# EAGLE board FJ60BLE (EAGLE 9.6.2), part 1 of 2
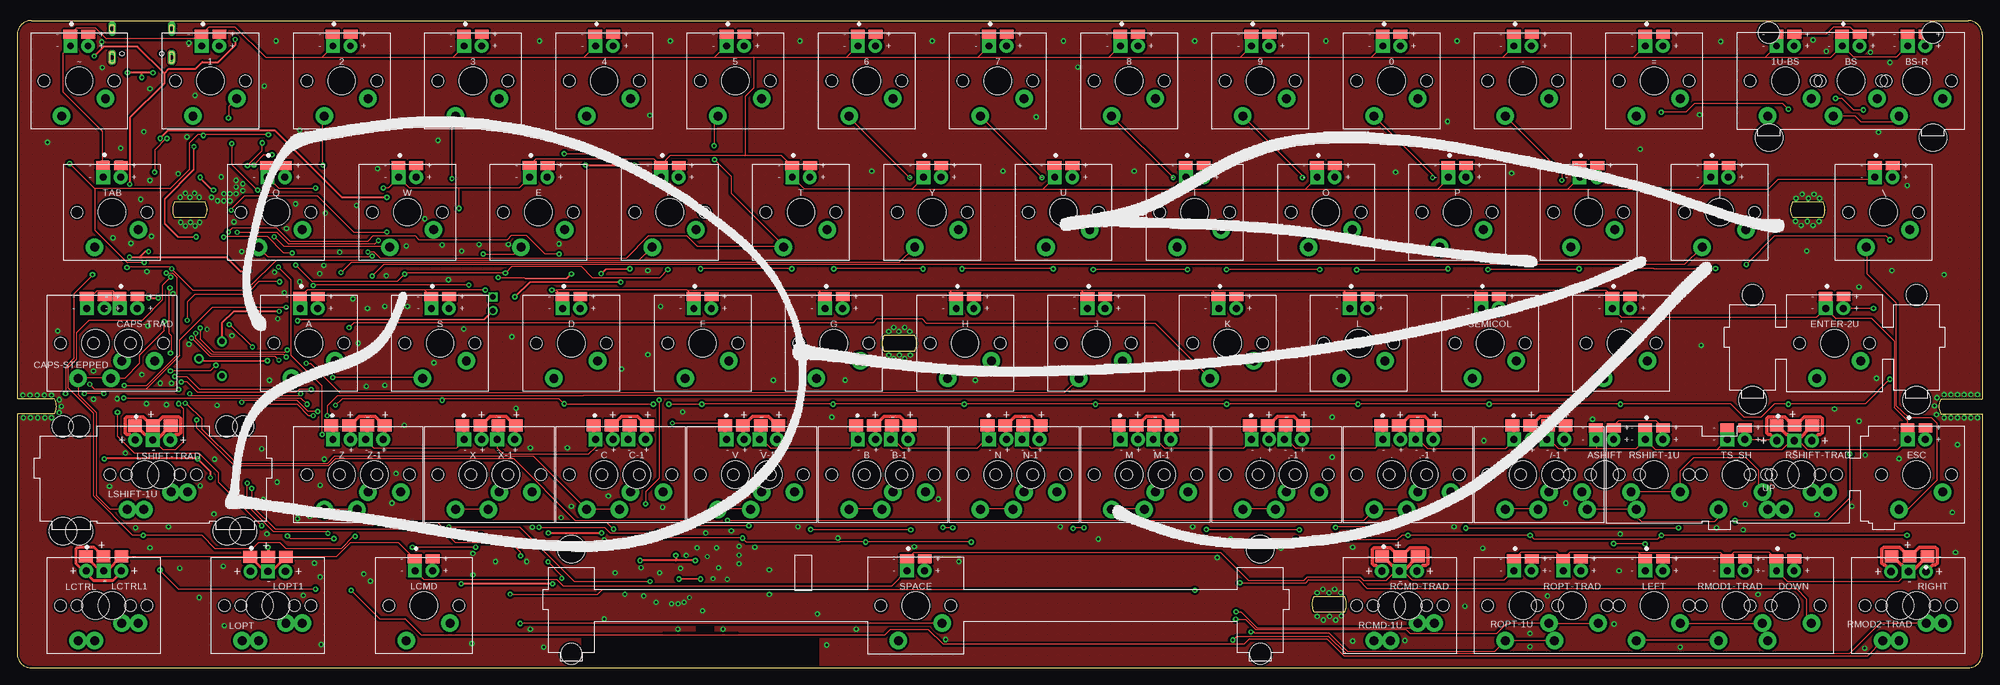
[diagram p7: board, top side]
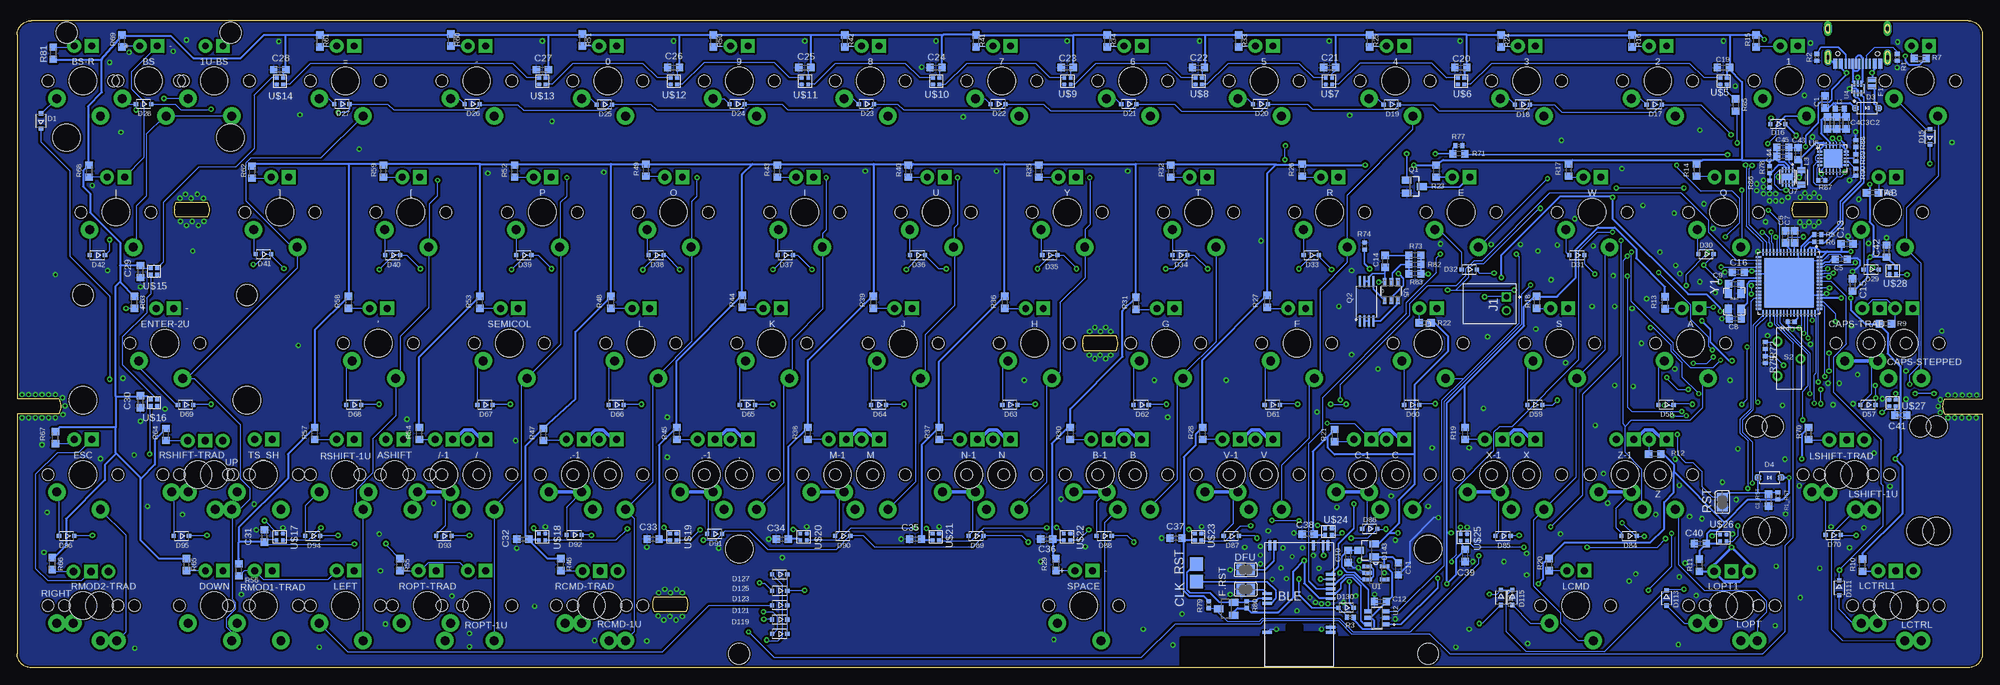
[diagram p8: board, bottom side, seen from below]

Size 285.25 x 93.95 mm. Coordinates in mm from the lower left corner, seen from the top.
Outline: 125.81,48.2 arc52 125.81,46
Outline: 257.65,67.6 arc52 257.65,65.4
Outline: 188.2,10.3 arc52 188.2,8.1
Outline: 27.55,66.53 27.55,66.47
Outline: 125.81,48.2 arc52 125.81,46
Outline: 130.3,46 arc52 130.3,48.2
Outline: 130.55,47.13 130.55,47.07
Outline: 130.3,48.2 125.81,48.2
Outline: 125.81,46 130.3,46
Outline: 188.2,10.3 arc52 188.2,8.1
Outline: 192.69,8.1 arc52 192.69,10.3
Outline: 192.95,9.23 192.95,9.17
Outline: 188.2,8.1 192.69,8.1
Outline: 192.69,10.3 188.2,10.3
Outline: 257.65,67.6 arc52 257.65,65.4
Outline: 262.14,65.4 arc52 262.14,67.6
Outline: 262.4,66.53 262.4,66.47
Outline: 262.14,67.6 257.65,67.6
Outline: 257.65,65.4 262.14,65.4
Outline: 262.14,65.4 arc52 262.14,67.6
Outline: 192.69,8.1 arc52 192.69,10.3
Outline: 130.3,46 arc52 130.3,48.2
Outline: 285.25,91.95 285.25,39.05 279.2,39.05 arc52 279.2,36.85 285.25,36.85 285.25,2 arc-90 283.25,0 2,0 arc-90 0,2 0,36.85 5.44,36.85 arc52 5.44,39.05 0,39.05 0,91.95 arc-90 2,93.95 283.25,93.95 arc-90 285.25,91.95
Outline: 22.81,67.6 arc52 22.81,65.4 27.3,65.4 arc52 27.3,67.6 22.81,67.6
Copper layers (1*16): Top 0.035mm / dielectric 1.5mm / Bottom 0.035mm
Design rules "default *": minimum track width 6mil, minimum drill 0.3mm, track to track 6mil, track to pad 6mil, pad to pad 0.2mm, via to via 6mil, smd to smd 6mil, copper to edge 6mil, drill to drill 6mil, minimum pad ring 10mil, minimum via ring 8mil, stop-mask expansion 4mil, vias tented up to drill 3.1mm, thermal gap 10mil
Net classes: 1 Matrix-Signals: width 0.152 mm, drill 0.152 mm, clearance 0.152 mm; 4 USB-Data: width 0.203 mm
tRestrict: area 82.1,0.1 to 116.2,4.3
bRestrict: area 82.1,0.1 to 116.2,4.3

## Footprints (pad centres in the part's own frame; a part is rotated, then mirrored left to right if it is on the bottom)
MX-1U-THTSMDLED = drill 1 pad 2: LED+ -1.27,-5.08 | drill 1 pad 2 square: LED- 1.27,-5.08 | drill 1.3 pad 2.54: MX1 -3.81,2.54; MX2 2.54,5.08 | smd 2 x 1.3: SMDLED+ -1.3,-6.785; SMDLED- 1.3,-6.785 | hole 4: 0,0 | hole 1.7: -5.08,0; 5.08,0
MX-1U-LED = drill 1 pad 2: LED+ -1.27,-5.08 | drill 1 pad 2 square: LED- 1.27,-5.08 | drill 1.3 pad 2.54: MX1 -3.81,2.54; MX2 2.54,5.08 | hole 4: 0,0 | hole 1.7: -5.08,0; 5.08,0
MDBT40-NO-EXTRA = smd 1.4 x 0.4: 1 -4.6,4; 2 -4.6,3.3; 3 -4.6,-0.9; 4 -4.6,-1.6; 5 -4.6,-2.3; 6 -4.6,-3; 7 -4.6,-3.7; 8 -4.6,-4.4; 34 4.6,-1.6; 35 4.6,-0.9; 36 4.6,-0.191; 42 4.6,4 | smd 0.4 x 1.4: 13 -4.2,-8.6; 14 -3.5,-8.6; 16 -2.1,-8.6; 24 3.5,-8.6; 25 4.2,-8.6
MX-2U-THTSMDLED-FLIPPED = drill 1 pad 2: LED+ -1.27,-5.08 | drill 1 pad 2 square: LED- 1.27,-5.08 | drill 1.3 pad 2.54: MX1 -3.81,2.54; MX2 2.54,5.08 | smd 2 x 1.3: SMDLED+ -1.3,-6.785; SMDLED- 1.3,-6.785 | hole 4: 0,0; -11.9,8.24; 11.9,8.24 | hole 1.7: -5.08,0; 5.08,0 | hole 3.05: -11.9,-7; 11.9,-7
C0603 = smd 1.05 x 1.08: 1 -0.875,0; 2 0.875,0
SOD323-R = smd 0.6 x 0.6: A 1.1,0; C -1.1,0
SOD-123 = smd 1.02 x 0.86: A 1.68,0; C -1.68,0
SOT23 = smd 1 x 1.4: 1 -0.95,-1.1; 2 0.95,-1.1; 3 0,1.1
SJ = smd 1.168 x 1.6: 1 -0.762,0; 2 0.762,0
CAPC1210X112N = smd 0.73 x 1.19: 1 -0.506,0; 2 0.506,0
JST_S2B-PH-K-S(LF)(SN) = drill 0.8 square: 1 -1,0 | drill 0.8: 2 1,0
HEADER-2X1-2.54 = smd 1.905 x 1.905: P$1 -1.27,0; P$2 1.27,0
0402 = smd 0.7 x 0.9: 1 -0.65,0; 2 0.65,0
INDC2009X120 = smd 0.876 x 1.21: 1 -1.067,0; 2 1.067,0
MX-1U = drill 1.3 pad 2.54: MX1 -3.81,2.54; MX2 2.54,5.08 | hole 4: 0,0 | hole 1.7: -5.08,0; 5.08,0
SMD-LED-UNIVERSAL-2-PLACEMENTS = smd 2 x 1.75: MINUS1 -2.63,0; MINUS2 2.57,0; PLUS -0.03,0
LED-THT-2PLACEMENT = drill 1.05 pad 2 square: 1 0,0 | drill 1.05 pad 2: 2 2.54,0; 3 -2.54,0
SMD-LED-UNIVERSAL-DUAL = smd 2 x 1.75: MINUS1 -3.9,0; MINUS2 1.3,0; PLUS1 -1.3,0; PLUS2 3.84,0
MX-2U-FLIPPED = drill 1.3 pad 2.54: MX1 -3.81,2.54; MX2 2.54,5.08 | hole 4: 0,0; -11.9,8.24; 11.9,8.24 | hole 1.7: -5.08,0; 5.08,0 | hole 3.05: -11.9,-7; 11.9,-7
SSOT-3 = smd 1 x 1.4: 1 -0.95,-1.1; 2 0.95,-1.1; 3 0,1.1
SOP65P640X120-8N = smd 1.56 x 0.4: 1 -2.88,0.975; 2 -2.88,0.325; 3 -2.88,-0.325; 4 -2.88,-0.975; 5 2.88,-0.975; 6 2.88,-0.325; 7 2.88,0.325; 8 2.88,0.975
R0402 = smd 0.6 x 0.7: 1 -0.5,0; 2 0.5,0
R0603 = smd 1.05 x 1.08: 1 -0.875,0; 2 0.875,0
SSSS213000 = drill 0.8 pad 1.4: P1 1.65,2.5; P2 -1.65,0; P3 1.65,-2.5
MX-6.25U-THTSMDLED = drill 1 pad 2: LED+ -1.27,-5.08 | drill 1 pad 2 square: LED- 1.27,-5.08 | drill 1.3 pad 2.54: MX1 -3.81,2.54; MX2 2.54,5.08 | smd 2 x 1.3: SMDLED+ -1.3,-6.785; SMDLED- 1.3,-6.785 | hole 4: 0,0; -50,-8.24; 50,-8.24 | hole 1.7: -5.08,0; 5.08,0 | hole 3.05: -50,7; 50,7
SOT95P280X130-5N = smd 1.321 x 0.559: 1 -1.27,0.94; 2 -1.27,0; 3 -1.27,-0.94; 4 1.27,-0.94; 5 1.27,0.94
SOT95P280X145-6N = smd 1.21 x 0.58: 1 -1.255,0.95; 2 -1.255,0; 3 -1.255,-0.95; 4 1.255,-0.95; 5 1.255,0; 6 1.255,0.95
QFN50P900X900X100-65N = smd 0.84 x 0.26: 1 -4.435,3.75; 2 -4.435,3.25; 3 -4.435,2.75; 4 -4.435,2.25; 5 -4.435,1.75; 6 -4.435,1.25; 7 -4.435,0.75; 8 -4.435,0.25; 9 -4.435,-0.25; 10 -4.435,-0.75; 11 -4.435,-1.25; 12 -4.435,-1.75; 13 -4.435,-2.25; 14 -4.435,-2.75; 15 -4.435,-3.25; 16 -4.435,-3.75; 33 4.435,-3.75; 34 4.435,-3.25; 35 4.435,-2.75; 36 4.435,-2.25; 37 4.435,-1.75; 38 4.435,-1.25; 39 4.435,-0.75; 40 4.435,-0.25; 41 4.435,0.25; 42 4.435,0.75; 43 4.435,1.25; 44 4.435,1.75; 45 4.435,2.25; 46 4.435,2.75; 47 4.435,3.25; 48 4.435,3.75 | smd 0.26 x 0.84: 17 -3.75,-4.435; 18 -3.25,-4.435; 19 -2.75,-4.435; 20 -2.25,-4.435; 21 -1.75,-4.435; 22 -1.25,-4.435; 23 -0.75,-4.435; 24 -0.25,-4.435; 25 0.25,-4.435; 26 0.75,-4.435; 27 1.25,-4.435; 28 1.75,-4.435; 29 2.25,-4.435; 30 2.75,-4.435; 31 3.25,-4.435; 32 3.75,-4.435; 49 3.75,4.435; 50 3.25,4.435; 51 2.75,4.435; 52 2.25,4.435; 53 1.75,4.435; 54 1.25,4.435; 55 0.75,4.435; 56 0.25,4.435; 57 -0.25,4.435; 58 -0.75,4.435; 59 -1.25,4.435; 60 -1.75,4.435; 61 -2.25,4.435; 62 -2.75,4.435; 63 -3.25,4.435; 64 -3.75,4.435 | smd 7.15 x 7.15: 65 0,0
SOT50P160X60-6N = smd 0.75 x 0.35: 1 -0.69,0.5; 2 -0.69,0; 3 -0.69,-0.5; 4 0.69,-0.5; 5 0.69,0; 6 0.69,0.5
FS312F-G = smd 1.13 x 0.559: 1 -1.34,0.95; 2 -1.34,0; 3 -1.34,-0.95; 4 1.34,-0.95; 5 1.34,0; 6 1.34,0.95
QFN50P400X400X100-21N = smd 0.84 x 0.26: 1 -1.935,1; 2 -1.935,0.5; 3 -1.935,0; 4 -1.935,-0.5; 5 -1.935,-1; 11 1.935,-1; 12 1.935,-0.5; 13 1.935,0; 14 1.935,0.5; 15 1.935,1 | smd 0.26 x 0.84: 6 -1,-1.935; 7 -0.5,-1.935; 8 0,-1.935; 9 0.5,-1.935; 10 1,-1.935; 16 1,1.935; 17 0.5,1.935; 18 0,1.935; 19 -0.5,1.935; 20 -1,1.935 | smd 2.7 x 2.7: 21 0,0
SON50P200X200X80-9N = smd 0.74 x 0.28: 1 -0.985,0.75; 2 -0.985,0.25; 3 -0.985,-0.25; 4 -0.985,-0.75; 5 0.985,-0.75; 6 0.985,-0.25; 7 0.985,0.25; 8 0.985,0.75 | smd 0.9 x 1.6: 9 0,0
SOT-23 = smd 1 x 1.4: D 0,1.1; G -0.95,-1.1; S 0.95,-1.1
SK6805 = smd 0.55 x 0.55: DIN -0.5,-0.5; DOUT 0.45,0.45; GND -0.5,0.45; VCC 0.45,-0.5
LED0805 = smd 1.2 x 1.25: + 1.05,0; - -1.05,0
TYPE-C-31-M-12 = smd 0.6 x 1.45: A1 -3.25,4.045; A4 -2.45,4.045; B1 3.25,4.045; B4 2.45,4.045 | smd 0.3 x 1.45: A5 -1.25,4.045; A6 -0.25,4.045; A7 0.25,4.045; A8 1.25,4.045; B5 1.75,4.045; B6 0.75,4.045; B7 -0.75,4.045; B8 -1.75,4.045 | drill 0.6 pad 1 long: SHIELD@1 -4.32,3.13; SHIELD@2 4.32,3.13 | drill 0.6 pad 0.8 long: SHIELD@3 4.32,-1.05; SHIELD@4 -4.32,-1.05 | hole 0.65: -2.89,2.6; 2.89,2.6
CRYSTAL-3.2X2.5 = smd 1.3 x 1.05: 1 -1.15,-0.925; 2 1.15,-0.925; 3 1.15,0.925; 4 -1.15,0.925

## Placement (x,y rotation side)
0  KEYSWITCH-THTSMDLED-MX-1U-THTSMDLED  [MX-1U-THTSMDLED]  199.5,85.2 180 top
1  KEYSWITCH-THTSMDLED-MX-1U-THTSMDLED  [MX-1U-THTSMDLED]  28.05,85.2 180 top
1U-BS  KEYSWITCH-THTSMDLED-MX-1U-THTSMDLED  [MX-1U-THTSMDLED]  256.65,85.2 180 top
2  KEYSWITCH-THTSMDLED-MX-1U-THTSMDLED  [MX-1U-THTSMDLED]  47.1,85.2 180 top
3  KEYSWITCH-THTSMDLED-MX-1U-THTSMDLED  [MX-1U-THTSMDLED]  66.15,85.2 180 top
4  KEYSWITCH-THTSMDLED-MX-1U-THTSMDLED  [MX-1U-THTSMDLED]  85.2,85.2 180 top
5  KEYSWITCH-THTSMDLED-MX-1U-THTSMDLED  [MX-1U-THTSMDLED]  104.25,85.2 180 top
6  KEYSWITCH-THTSMDLED-MX-1U-THTSMDLED  [MX-1U-THTSMDLED]  123.3,85.2 180 top
7  KEYSWITCH-THTSMDLED-MX-1U-THTSMDLED  [MX-1U-THTSMDLED]  142.35,85.2 180 top
8  KEYSWITCH-THTSMDLED-MX-1U-THTSMDLED  [MX-1U-THTSMDLED]  161.4,85.2 180 top
9  KEYSWITCH-THTSMDLED-MX-1U-THTSMDLED  [MX-1U-THTSMDLED]  180.45,85.2 180 top
'  KEYSWITCH-THTSMDLED-MX-1U-THTSMDLED  [MX-1U-THTSMDLED]  232.84,47.1 180 top
,  KEYSWITCH-LED-MX-1U-LED  [MX-1U-LED]  180.45,28.05 180 top
,-1  KEYSWITCH-LED-MX-1U-LED  [MX-1U-LED]  185.21,28.05 180 top
-  KEYSWITCH-THTSMDLED-MX-1U-THTSMDLED  [MX-1U-THTSMDLED]  218.55,85.2 180 top
.  KEYSWITCH-LED-MX-1U-LED  [MX-1U-LED]  199.5,28.05 180 top
.-1  KEYSWITCH-LED-MX-1U-LED  [MX-1U-LED]  204.26,28.05 180 top
/  KEYSWITCH-LED-MX-1U-LED  [MX-1U-LED]  218.55,28.05 180 top
/-1  KEYSWITCH-LED-MX-1U-LED  [MX-1U-LED]  223.31,28.05 180 top
=  KEYSWITCH-THTSMDLED-MX-1U-THTSMDLED  [MX-1U-THTSMDLED]  237.6,85.2 180 top
[  KEYSWITCH-THTSMDLED-MX-1U-THTSMDLED  [MX-1U-THTSMDLED]  228.07,66.15 180 top
]  KEYSWITCH-THTSMDLED-MX-1U-THTSMDLED  [MX-1U-THTSMDLED]  247.12,66.15 180 top
A  KEYSWITCH-THTSMDLED-MX-1U-THTSMDLED  [MX-1U-THTSMDLED]  42.34,47.1 180 top
ASHIFT  KEYSWITCH-THTSMDLED-MX-1U-THTSMDLED  [MX-1U-THTSMDLED]  230.46,28.05 180 top
B  KEYSWITCH-LED-MX-1U-LED  [MX-1U-LED]  123.3,28.05 180 top
B-1  KEYSWITCH-LED-MX-1U-LED  [MX-1U-LED]  128.06,28.05 180 top
BLE  MDBT40-NO-EXTRAMDBT40-NO-EXTRA  [MDBT40-NO-EXTRA]  99.19,9.15 180 bottom
BS  KEYSWITCH-THTSMDLED-MX-2U-THTSMDLED-FLIPPED  [MX-2U-THTSMDLED-FLIPPED]  266.18,85.2 180 top
BS-R  KEYSWITCH-THTSMDLED-MX-1U-THTSMDLED  [MX-1U-THTSMDLED]  275.7,85.2 180 top
C  KEYSWITCH-LED-MX-1U-LED  [MX-1U-LED]  85.2,28.05 180 top
C1  10uF  [C0603]  22.84,82.15 270 bottom
C1_RST  100nF  [C0603]  31.03,24.33 90 bottom
C2  10uF  [C0603]  19.79,79.1 90 bottom
C3  1uF  [C0603]  21.13,79.1 90 bottom
C4  100nF  [C0603]  22.47,79.1 90 bottom
C5  100nF  [C0603]  20.46,59.3 180 bottom
C6  1uF  [C0603]  28.57,62.58 270 bottom
C7  1uF  [C0603]  27.23,62.58 270 bottom
C8  12pF  [C0603]  35.86,50.67 180 bottom
C9  12pF  [C0603]  35.94,55.73 0 bottom
C10  1uF  [C0603]  92.05,16.14 90 bottom
C11  10uF  [C0603]  84.75,14.36 90 bottom
C12  1uF  [C0603]  87.36,9.6 0 bottom
C13  10uF  [C0603]  19.64,61.54 180 bottom
C14  100nF  [C0603]  86.69,59.01 90 bottom
C15  10uF  [C0603]  18.82,55.58 270 bottom
C16  10uF  [C0603]  35.42,57.44 0 bottom
C19  100nF  [C0603]  37.58,87.13 0 bottom
C20  100nF  [C0603]  75.67,87.13 0 bottom
C21  100nF  [C0603]  94.73,87.13 0 bottom
C22  100nF  [C0603]  113.78,87.13 0 bottom
C23  100nF  [C0603]  132.82,87.13 0 bottom
C24  100nF  [C0603]  151.88,87.13 0 bottom
C25  100nF  [C0603]  170.92,87.13 0 bottom
C26  100nF  [C0603]  189.97,87.13 0 bottom
C27  100nF  [C0603]  209.02,86.84 0 bottom
C28  100nF  [C0603]  247.12,86.84 0 bottom
C29  100nF  [C0603]  267.37,57.52 90 bottom
C30  100nF  [C0603]  267.37,38.62 90 bottom
C31  100nF  [C0603]  249.36,19.12 270 bottom
C32  100nF  [C0603]  211.85,18.67 0 bottom
C33  100nF  [C0603]  192.95,18.67 0 bottom
C34  100nF  [C0603]  174.2,18.67 0 bottom
C35  100nF  [C0603]  154.85,18.67 0 bottom
C36  100nF  [C0603]  135.8,18.67 0 bottom
C37  100nF  [C0603]  117.05,18.82 0 bottom
C38  100nF  [C0603]  97.85,19.42 0 bottom
C39  100nF  [C0603]  75.08,16.29 90 bottom
C40  100nF  [C0603]  40.92,18 0 bottom
C41  100nF  [C0603]  11.83,36.68 180 bottom
C42  100nF  [C0603]  13.91,60.49 270 bottom
C43  10uF  [C0603]  26.71,74.63 270 bottom
C44  10uF  [C0603]  28.94,74.26 180 bottom
C45  10uF  [C0603]  28.94,75.53 180 bottom
C-1  KEYSWITCH-LED-MX-1U-LED  [MX-1U-LED]  89.96,28.05 180 top
CAPS-STEPPED  KEYSWITCH-THTSMDLED-MX-1U-THTSMDLED  [MX-1U-THTSMDLED]  11.38,47.1 180 top
CAPS-TRAD  KEYSWITCH-THTSMDLED-MX-1U-THTSMDLED  [MX-1U-THTSMDLED]  16.14,47.1 180 top
D  KEYSWITCH-THTSMDLED-MX-1U-THTSMDLED  [MX-1U-THTSMDLED]  80.44,47.1 180 top
D1  [SOD323-R]  281.8,79.4 90 bottom
D3  MBR0520LT1G  [SOD-123]  16.74,81.26 0 bottom
D4  MBR0520LT1G  [SOD-123]  30.88,27.6 180 bottom
D15  [SOD323-R]  7.59,77.09 90 bottom
D16  [SOD323-R]  29.69,78.95 180 bottom
D17  [SOD323-R]  47.62,81.78 180 bottom
D18  [SOD323-R]  66.75,81.78 180 bottom
D19  [SOD323-R]  85.8,81.78 180 bottom
D20  [SOD323-R]  104.77,81.85 180 bottom
D21  [SOD323-R]  123.9,81.85 180 bottom
D22  [SOD323-R]  142.87,81.85 180 bottom
D23  [SOD323-R]  162,81.85 180 bottom
D24  [SOD323-R]  180.75,81.85 180 bottom
D25  [SOD323-R]  200.02,81.78 180 bottom
D26  [SOD323-R]  219.22,81.85 180 bottom
D27  [SOD323-R]  238.12,81.85 180 bottom
D28  [SOD323-R]  266.92,81.85 180 bottom
D29  [SOD323-R]  16.14,57.82 180 bottom
D30  [SOD323-R]  40.11,60.05 180 bottom
D31  [SOD323-R]  58.86,59.9 180 bottom
D32  [SOD323-R]  74.48,57.82 180 bottom
D33  [SOD323-R]  97.4,59.9 180 bottom
D34  [SOD323-R]  116.45,59.9 180 bottom
D35  [SOD323-R]  135.36,59.9 180 bottom
D36  [SOD323-R]  154.55,59.9 180 bottom
D37  [SOD323-R]  173.75,59.9 180 bottom
D38  [SOD323-R]  192.51,59.9 180 bottom
D39  [SOD323-R]  211.7,59.9 180 bottom
D40  [SOD323-R]  230.75,59.9 180 bottom
D41  [SOD323-R]  249.51,60.05 180 bottom
D42  [SOD323-R]  273.62,59.9 180 bottom
D57  [SOD323-R]  16.59,38.17 180 bottom
D58  [SOD323-R]  45.91,38.17 180 bottom
D59  [SOD323-R]  64.96,38.17 180 bottom
D60  [SOD323-R]  82.82,38.17 180 bottom
D61  [SOD323-R]  103.06,38.17 180 bottom
D62  [SOD323-R]  122.11,38.17 180 bottom
D63  [SOD323-R]  141.16,38.17 180 bottom
D64  [SOD323-R]  160.21,38.17 180 bottom
D65  [SOD323-R]  179.26,38.17 180 bottom
D66  [SOD323-R]  198.31,38.17 180 bottom
D67  [SOD323-R]  217.36,38.17 180 bottom
D68  [SOD323-R]  236.41,38.17 180 bottom
D69  [SOD323-R]  260.82,38.17 180 bottom
D70  [SOD323-R]  21.65,19.27 180 bottom
D84  [SOD323-R]  51.27,19.12 180 bottom
D85  [SOD323-R]  69.57,19.12 180 bottom
D86  [SOD323-R]  88.92,20.16 180 bottom
D87  [SOD323-R]  109.01,19.12 180 bottom
D88  [SOD323-R]  127.47,19.12 180 bottom
D89  [SOD323-R]  146.07,19.12 180 bottom
D90  [SOD323-R]  165.42,19.12 180 bottom
D91  [SOD323-R]  184.02,19.42 180 bottom
D92  [SOD323-R]  204.41,19.27 180 bottom
D93  [SOD323-R]  223.31,19.12 180 bottom
D94  [SOD323-R]  242.36,19.12 180 bottom
D95  [SOD323-R]  261.41,19.12 180 bottom
D96  [SOD323-R]  278.08,19.12 180 bottom
D111  [SOD323-R]  20.76,11.6 270 bottom
D113  [SOD323-R]  45.83,10.12 270 bottom
D115  [SOD323-R]  68.23,10.19 270 bottom
D117  [SOD323-R]  69.87,10.19 270 bottom
D119  [SOD323-R]  174.57,4.91 180 bottom
D121  [SOD323-R]  174.57,6.99 180 bottom
D123  [SOD323-R]  174.57,9.07 180 bottom
D125  [SOD323-R]  174.57,11.16 180 bottom
D127  [SOD323-R]  174.57,13.54 180 bottom
D130  [SOD323-R]  92.34,8.7 180 bottom
D143  PMEG2005CT  [SOT23]  89.37,17.04 90 bottom
DFU  [SJ]  106.93,14.21 180 bottom
DOWN  KEYSWITCH-THTSMDLED-MX-1U-THTSMDLED  [MX-1U-THTSMDLED]  256.65,9 180 top
E  KEYSWITCH-THTSMDLED-MX-1U-THTSMDLED  [MX-1U-THTSMDLED]  75.67,66.15 180 top
ENTER-2U  KEYSWITCH-THTSMDLED-MX-2U-THTSMDLED-FLIPPED  [MX-2U-THTSMDLED-FLIPPED]  263.79,47.1 180 top
ESC  KEYSWITCH-THTSMDLED-MX-1U-THTSMDLED  [MX-1U-THTSMDLED]  275.7,28.05 180 top
F  KEYSWITCH-THTSMDLED-MX-1U-THTSMDLED  [MX-1U-THTSMDLED]  99.49,47.1 180 top
F1  MF-MSMF075-2  [CAPC1210X112N]  15.99,84.9 270 bottom
F.RST  [SJ]  106.93,11.38 180 bottom
G  KEYSWITCH-THTSMDLED-MX-1U-THTSMDLED  [MX-1U-THTSMDLED]  118.54,47.1 180 top
H  KEYSWITCH-THTSMDLED-MX-1U-THTSMDLED  [MX-1U-THTSMDLED]  137.59,47.1 180 top
I  KEYSWITCH-THTSMDLED-MX-1U-THTSMDLED  [MX-1U-THTSMDLED]  170.92,66.15 180 top
J  KEYSWITCH-THTSMDLED-MX-1U-THTSMDLED  [MX-1U-THTSMDLED]  156.64,47.1 180 top
J1  S2B-PH-K-S(LF)(SN)  [JST_S2B-PH-K-S(LF)(SN)]  69.05,52.83 270 bottom
J2  SWD-2-WIRE  [HEADER-2X1-2.54]  114.07,13.76 270 bottom
K  KEYSWITCH-THTSMDLED-MX-1U-THTSMDLED  [MX-1U-THTSMDLED]  175.69,47.1 180 top
L  KEYSWITCH-THTSMDLED-MX-1U-THTSMDLED  [MX-1U-THTSMDLED]  194.74,47.1 180 top
L2  120Ω @ 100MHz  [0402]  20.68,81.18 0 bottom
L3  1uH  [INDC2009X120]  26.26,71.21 270 bottom
LCMD  KEYSWITCH-THTSMDLED-MX-1U-THTSMDLED  [MX-1U-THTSMDLED]  59.01,9 180 top
LCTRL  KEYSWITCH-PLAIN-MX-1U  [MX-1U]  11.38,9 180 top
LCTRL1  KEYSWITCH-PLAIN-MX-1U  [MX-1U]  13.76,9 180 top
LCTRL-LSMD1  [SMD-LED-UNIVERSAL-2-PLACEMENTS]  12.5,16.14 180 top
LCTRL-LTHT1  [LED-THT-2PLACEMENT]  12.57,14.06 0 top
LED1  [SMD-LED-UNIVERSAL-DUAL]  49.48,35.19 0 top
LED2  [SMD-LED-UNIVERSAL-DUAL]  68.53,35.19 0 top
LED3  [SMD-LED-UNIVERSAL-DUAL]  87.58,35.19 0 top
LED4  [SMD-LED-UNIVERSAL-DUAL]  106.63,35.19 0 top
LED5  [SMD-LED-UNIVERSAL-DUAL]  125.68,35.19 0 top
LED6  [SMD-LED-UNIVERSAL-DUAL]  144.73,35.19 0 top
LED7  [SMD-LED-UNIVERSAL-DUAL]  163.78,35.19 0 top
LED8  [SMD-LED-UNIVERSAL-DUAL]  182.83,35.19 0 top
LED9  [SMD-LED-UNIVERSAL-DUAL]  201.88,35.19 0 top
LED10  [SMD-LED-UNIVERSAL-DUAL]  220.93,35.19 0 top
LEFT  KEYSWITCH-THTSMDLED-MX-1U-THTSMDLED  [MX-1U-THTSMDLED]  237.6,9 180 top
LOPT  KEYSWITCH-PLAIN-MX-1U  [MX-1U]  35.19,9 180 top
LOPT1  KEYSWITCH-PLAIN-MX-1U  [MX-1U]  37.58,9 180 top
LOPT-LSMD1  [SMD-LED-UNIVERSAL-2-PLACEMENTS]  36.38,16.07 180 top
LOPT-LTHT1  [LED-THT-2PLACEMENT]  36.38,13.99 0 top
LSHIFT-1U  KEYSWITCH-PLAIN-MX-2U-FLIPPED  [MX-2U-FLIPPED]  18.52,28.05 180 top
LSHIFT-LSMD  [SMD-LED-UNIVERSAL-2-PLACEMENTS]  19.66,35.14 180 top
LSHIFT-LTHT  [LED-THT-2PLACEMENT]  19.67,33.06 0 top
LSHIFT-TRAD  KEYSWITCH-PLAIN-MX-2U-FLIPPED  [MX-2U-FLIPPED]  20.91,28.05 180 top
M  KEYSWITCH-LED-MX-1U-LED  [MX-1U-LED]  161.4,28.05 180 top
M-1  KEYSWITCH-LED-MX-1U-LED  [MX-1U-LED]  166.16,28.05 180 top
N  KEYSWITCH-LED-MX-1U-LED  [MX-1U-LED]  142.35,28.05 180 top
N-1  KEYSWITCH-LED-MX-1U-LED  [MX-1U-LED]  147.11,28.05 180 top
O  KEYSWITCH-THTSMDLED-MX-1U-THTSMDLED  [MX-1U-THTSMDLED]  189.97,66.15 180 top
P  KEYSWITCH-THTSMDLED-MX-1U-THTSMDLED  [MX-1U-THTSMDLED]  209.02,66.15 180 top
Q  KEYSWITCH-THTSMDLED-MX-1U-THTSMDLED  [MX-1U-THTSMDLED]  37.58,66.15 180 top
Q1  FDN337N  [SSOT-3]  82.45,69.87 270 bottom
Q2  FS8205A  [SOP65P640X120-8N]  89.37,53.2 90 bottom
R  KEYSWITCH-THTSMDLED-MX-1U-THTSMDLED  [MX-1U-THTSMDLED]  94.73,66.15 180 top
R1  5.1K  [R0402]  12.35,88.62 90 bottom
R1_RST  10K  [R0402]  29.69,24.92 270 bottom
R2  5.1K  [R0402]  24.03,88.62 270 bottom
R3  10K  [R0402]  91.75,7.29 0 bottom
R4  1K  [R0402]  27.75,50.23 0 bottom
R5  22  [R0402]  23.88,62.88 180 bottom
R6  22  [R0402]  23.88,61.83 180 bottom
R7  300  [R0603]  9,88.47 0 bottom
R8  300  [R0603]  15.92,68.98 180 bottom
R9  300  [R0603]  14.06,49.93 180 bottom
R10  300  [R0603]  17.41,14.88 90 bottom
R11  300  [R0603]  41.07,14.88 90 bottom
R12  300  [R0603]  47.55,31.03 0 bottom
R13  300  [R0603]  46.06,52.98 90 bottom
R14  300  [R0603]  41.44,72.25 90 bottom
R15  300  [R0603]  32.81,91 90 bottom
R16  300  [R0603]  50.82,91 90 bottom
R17  300  [R0603]  60.05,72.25 90 bottom
R18  300  [R0603]  64.66,53.05 90 bottom
R19  300  [R0603]  75.08,34 90 bottom
R20  300  [R0603]  62.88,14.95 90 bottom
R21  300  [R0603]  93.98,33.71 90 bottom
R22  300  [R0603]  80.88,50.08 0 bottom
R23  300  [R0603]  79.25,72.1 90 bottom
R24  300  [R0603]  69.87,91 90 bottom
R25  300  [R0603]  88.92,91 90 bottom
R26  300  [R0603]  98.74,72.25 90 bottom
R27  300  [R0603]  103.8,53.2 90 bottom
R28  300  [R0603]  113.18,34 90 bottom
R29  300  [R0603]  134.46,14.95 90 bottom
R30  300  [R0603]  132.38,34 90 bottom
R31  300  [R0603]  122.85,52.9 90 bottom
R32  300  [R0603]  117.79,72.1 90 bottom
R33  300  [R0603]  107.97,91 90 bottom
R34  300  [R0603]  127.02,91 90 bottom
R35  300  [R0603]  136.99,72.1 90 bottom
R36  300  [R0603]  141.9,53.05 90 bottom
R37  300  [R0603]  151.43,34 90 bottom
R38  300  [R0603]  170.48,34 90 bottom
R39  300  [R0603]  160.95,53.05 90 bottom
R40  300  [R0603]  155.89,72.1 90 bottom
R41  300  [R0603]  146.07,91 90 bottom
R42  300  [R0603]  165.12,91 90 bottom
R43  300  [R0603]  174.94,72.1 90 bottom
R44  300  [R0603]  180,53.2 90 bottom
R45  300  [R0603]  189.53,34 90 bottom
R46  300  [R0603]  206.35,14.95 90 bottom
R47  300  [R0603]  208.88,33.85 90 bottom
R48  300  [R0603]  199.05,53.05 90 bottom
R49  300  [R0603]  193.99,72.25 90 bottom
R50  300  [R0603]  184.17,91 90 bottom
R51  300  [R0603]  203.22,91.15 90 bottom
R52  300  [R0603]  213.04,72.1 90 bottom
R53  300  [R0603]  218.1,53.05 90 bottom
R54  300  [R0603]  226.88,34 90 bottom
R55  300  [R0603]  229.71,14.95 90 bottom
R56  300  [R0603]  253.08,14.21 90 bottom
R57  300  [R0603]  242.06,34 90 bottom
R58  300  [R0603]  237.15,53.05 90 bottom
R59  300  [R0603]  232.09,72.1 90 bottom
R60  300  [R0603]  222.27,91.15 90 bottom
R61  300  [R0603]  241.32,91 90 bottom
R62  300  [R0603]  251.14,71.95 90 bottom
R63  300  [R0603]  268.26,53.05 90 bottom
R64  300  [R0603]  263.64,33.85 90 bottom
R65  300  [R0603]  260.67,14.95 90 bottom
R66  300  [R0603]  280.16,15.1 90 bottom
R67  300  [R0603]  279.72,33.41 90 bottom
R68  300  [R0603]  274.81,72.1 90 bottom
R69  300  [R0603]  270.04,91 90 bottom
R70  300  [R0603]  25.22,34 90 bottom
R71  300  [R0603]  75.97,74.63 180 bottom
R72  7.2K  [R0402]  31.47,46.8 270 bottom
R73  300  [R0603]  82.37,59.9 0 bottom
R74  1K  [R0402]  89.66,61.24 270 bottom
R75  10K  [R0402]  31.47,44.72 270 bottom
R77  10K  [R0402]  75.97,75.82 180 bottom
R78  270K  [R0402]  30.88,72.33 90 bottom
R79  10K  [R0402]  112.29,9.15 270 bottom
R80  10K  [R0402]  106.78,9.15 90 bottom
R81  300  [R0603]  280.02,89.22 270 bottom
R82  300  [R0603]  82.37,58.56 0 bottom
R83  300  [R0603]  82.37,57.22 0 bottom
R85  300  [R0603]  35.79,81.7 90 bottom
R86  100K  [R0402]  30.88,70.24 90 bottom
R87  10K  [R0402]  23.29,70.76 180 bottom
R88  1K  [R0402]  18.38,76.12 270 bottom
R89  1K  [R0402]  18.38,74.04 270 bottom
R90  100K  [R0402]  18.38,71.95 90 bottom
RCMD-1U  KEYSWITCH-PLAIN-MX-1U  [MX-1U]  199.5,9 180 top
RCMD-LSMD  [SMD-LED-UNIVERSAL-2-PLACEMENTS]  200.7,16.15 180 top
RCMD-LTHT  [LED-THT-2PLACEMENT]  200.65,14.01 0 top
RCMD-TRAD  KEYSWITCH-PLAIN-MX-1U  [MX-1U]  201.88,9 180 top
RIGHT  KEYSWITCH-PLAIN-MX-1U  [MX-1U]  275.7,9 180 top
RIGHT-LSMD  [SMD-LED-UNIVERSAL-2-PLACEMENTS]  274.66,16.18 180 top
RIGHT-LTHT  [LED-THT-2PLACEMENT]  274.55,13.95 0 top
RMOD1-TRAD  KEYSWITCH-THTSMDLED-MX-1U-THTSMDLED  [MX-1U-THTSMDLED]  249.51,9 180 top
RMOD2-TRAD  KEYSWITCH-PLAIN-MX-1U  [MX-1U]  273.32,9 180 top
ROPT-1U  KEYSWITCH-THTSMDLED-MX-1U-THTSMDLED  [MX-1U-THTSMDLED]  218.55,9 180 top
ROPT-TRAD  KEYSWITCH-THTSMDLED-MX-1U-THTSMDLED  [MX-1U-THTSMDLED]  225.69,9 180 top
RSHIFT-1U  KEYSWITCH-THTSMDLED-MX-1U-THTSMDLED  [MX-1U-THTSMDLED]  237.6,28.05 180 top
RSHIFT-TRAD  KEYSWITCH-PLAIN-MX-1U  [MX-1U]  259.03,28.05 180 top
RST  [SJ]  37.72,24.03 90 bottom
S  KEYSWITCH-THTSMDLED-MX-1U-THTSMDLED  [MX-1U-THTSMDLED]  61.39,47.1 180 top
S2  SSSS213000  [SSSS213000]  28.05,44.87 180 bottom
SEMICOL  KEYSWITCH-THTSMDLED-MX-1U-THTSMDLED  [MX-1U-THTSMDLED]  213.79,47.1 180 top
SPACE  KEYSWITCH-THTSMDLED-MX-6.25U-THTSMDLED  [MX-6.25U-THTSMDLED]  130.44,9 180 top
T  KEYSWITCH-THTSMDLED-MX-1U-THTSMDLED  [MX-1U-THTSMDLED]  113.78,66.15 180 top
TAB  KEYSWITCH-THTSMDLED-MX-1U-THTSMDLED  [MX-1U-THTSMDLED]  13.76,66.15 180 top
TS_SH  KEYSWITCH-THTSMDLED-MX-1U-THTSMDLED  [MX-1U-THTSMDLED]  249.51,28.05 180 top
U  KEYSWITCH-THTSMDLED-MX-1U-THTSMDLED  [MX-1U-THTSMDLED]  151.88,66.15 180 top
U1  MIC5205-3.3YM5TR  [SOT95P280X130-5N]  88.03,13.76 0 bottom
U2  SN74LVC2G34DBVR  [SOT95P280X145-6N]  87.88,7.21 180 bottom
U3  AT90USB646  [QFN50P900X900X100-65N]  28.05,55.88 270 bottom
U4  USBLC6-2P6  [SOT50P160X60-6N]  18.08,84.08 90 bottom
U5  FS312F-G  [FS312F-G]  85.8,54.69 90 bottom
U6  MCP73871-2AAI/ML  [QFN50P400X400X100-21N]  21.65,73.96 0 bottom
U7  TPS61252DSGT  [SON50P200X200X80-9N]  28.27,71.28 270 bottom
U$1  BSS138  [SOT-23]  109.76,8.55 90 bottom
U$3  [FJLABSLOGO]  167.65,9.6 0 bottom
U$4  [FJ60BLXV1.0]  167.65,2.15 0 bottom
U$5  SK6805  [SK6805]  37.58,85.2 90 bottom
U$6  SK6805  [SK6805]  75.67,85.2 90 bottom
U$7  SK6805  [SK6805]  94.87,85.2 90 bottom
U$8  SK6805  [SK6805]  113.78,85.2 90 bottom
U$9  SK6805  [SK6805]  132.82,85.2 90 bottom
U$10  SK6805  [SK6805]  151.88,85.2 90 bottom
U$11  SK6805  [SK6805]  170.92,85.2 90 bottom
U$12  SK6805  [SK6805]  189.97,85.2 90 bottom
U$13  SK6805  [SK6805]  209.02,85.2 90 bottom
U$14  SK6805  [SK6805]  247.12,85.2 90 bottom
U$15  SK6805  [SK6805]  265.43,57.52 180 bottom
U$16  SK6805  [SK6805]  265.43,38.47 180 bottom
U$17  SK6805  [SK6805]  247.12,18.97 270 bottom
U$18  SK6805  [SK6805]  209.02,18.97 270 bottom
U$19  SK6805  [SK6805]  189.97,18.97 270 bottom
U$20  SK6805  [SK6805]  171.07,18.97 270 bottom
U$21  SK6805  [SK6805]  151.88,18.97 270 bottom
U$22  SK6805  [SK6805]  132.82,18.97 270 bottom
U$23  SK6805  [SK6805]  113.78,18.97 270 bottom
U$24  SK6805  [SK6805]  94.87,19.72 270 bottom
U$25  SK6805  [SK6805]  75.23,18.9 270 bottom
U$26  SK6805  [SK6805]  37.58,18.82 270 bottom
U$27  SK6805  [SK6805]  13.02,38.47 0 bottom
U$28  SK6805  [SK6805]  13.02,57.67 90 bottom
U$29  LED-0805  [LED0805]  11.23,16 0 top
U$30  LED-0805  [LED0805]  35.12,15.85 0 top
U$31  LED-0805  [LED0805]  59.01,15.77 0 top
U$32  LED-0805  [LED0805]  130.44,15.77 0 top
U$33  LED-0805  [LED0805]  199.43,16.07 0 top
U$34  LED-0805  [LED0805]  218.55,15.77 0 top
U$35  LED-0805  [LED0805]  237.6,34.82 0 top
U$36  LED-0805  [LED0805]  237.6,15.77 0 top
U$37  LED-0805  [LED0805]  180.23,35.12 0 top
U$38  LED-0805  [LED0805]  218.33,35.12 0 top
U$39  LED-0805  [LED0805]  142.13,35.12 0 top
U$40  LED-0805  [LED0805]  123.08,35.12 0 top
U$41  LED-0805  [LED0805]  156.64,53.87 0 top
U$42  LED-0805  [LED0805]  104.03,35.12 0 top
U$43  LED-0805  [LED0805]  199.28,35.12 0 top
U$44  LED-0805  [LED0805]  16.14,53.87 0 top
U$45  LED-0805  [LED0805]  256.65,15.77 0 top
U$46  LED-0805  [LED0805]  161.18,35.12 0 top
U$47  LED-0805  [LED0805]  151.88,72.92 0 top
U$48  LED-0805  [LED0805]  84.98,35.12 0 top
U$49  LED-0805  [LED0805]  276,16.07 180 top
U$50  LED-0805  [LED0805]  137.59,53.87 0 top
U$51  LED-0805  [LED0805]  256.72,35.05 0 top
U$52  LED-0805  [LED0805]  80.44,53.87 0 top
U$53  LED-0805  [LED0805]  247.12,72.92 0 top
U$54  LED-0805  [LED0805]  170.92,72.92 0 top
U$55  LED-0805  [LED0805]  275.7,34.82 0 top
U$56  LED-0805  [LED0805]  61.39,53.87 0 top
U$57  LED-0805  [LED0805]  175.69,53.87 0 top
U$58  LED-0805  [LED0805]  270.94,72.92 0 top
U$59  LED-0805  [LED0805]  42.34,53.87 0 top
U$60  LED-0805  [LED0805]  94.73,72.92 0 top
U$61  LED-0805  [LED0805]  118.54,53.87 0 top
U$62  LED-0805  [LED0805]  99.49,53.87 0 top
U$63  LED-0805  [LED0805]  199.5,91.97 0 top
U$64  LED-0805  [LED0805]  28.05,91.97 0 top
U$65  LED-0805  [LED0805]  9,91.97 0 top
U$66  LED-0805  [LED0805]  228.07,72.92 0 top
U$67  LED-0805  [LED0805]  218.55,91.97 0 top
U$68  LED-0805  [LED0805]  237.6,91.97 0 top
U$69  LED-0805  [LED0805]  113.78,72.92 0 top
U$70  LED-0805  [LED0805]  47.1,91.97 0 top
U$71  LED-0805  [LED0805]  75.67,72.92 0 top
U$72  LED-0805  [LED0805]  56.62,72.92 0 top
U$73  LED-0805  [LED0805]  132.82,72.92 0 top
U$74  LED-0805  [LED0805]  104.25,91.97 0 top
U$75  LED-0805  [LED0805]  66.15,91.97 0 top
U$76  LED-0805  [LED0805]  263.79,53.87 0 top
U$77  LED-0805  [LED0805]  37.58,72.92 0 top
U$78  LED-0805  [LED0805]  266.18,91.97 0 top
U$79  LED-0805  [LED0805]  161.4,91.97 0 top
U$80  LED-0805  [LED0805]  85.2,91.97 0 top
U$81  LED-0805  [LED0805]  18.38,34.97 0 top
U$82  LED-0805  [LED0805]  194.74,53.87 0 top
U$83  LED-0805  [LED0805]  180.45,91.97 0 top
U$84  LED-0805  [LED0805]  142.35,91.97 0 top
U$85  LED-0805  [LED0805]  123.3,91.97 0 top
U$86  LED-0805  [LED0805]  46.88,35.12 0 top
U$87  LED-0805  [LED0805]  213.79,53.87 0 top
U$88  LED-0805  [LED0805]  13.76,73 0 top
U$89  LED-0805  [LED0805]  209.02,72.92 0 top
U$90  LED-0805  [LED0805]  189.97,72.92 0 top
U$91  LED-0805  [LED0805]  65.93,35.12 0 top
U$92  LED-0805  [LED0805]  232.84,53.87 0 top
U$93  [WHITE_TULIP]  25.15,12.13 0 top
UP  KEYSWITCH-PLAIN-MX-1U  [MX-1U]  256.65,28.05 180 top
UP-LSMD  [SMD-LED-UNIVERSAL-2-PLACEMENTS]  257.96,35.16 180 top
UP-LTHT  [LED-THT-2PLACEMENT]  257.95,32.95 0 top
USB-C  USB-C  [TYPE-C-31-M-12]  18.08,91.75 180 bottom
V  KEYSWITCH-LED-MX-1U-LED  [MX-1U-LED]  104.25,28.05 180 top
V-1  KEYSWITCH-LED-MX-1U-LED  [MX-1U-LED]  109.01,28.05 180 top
W  KEYSWITCH-THTSMDLED-MX-1U-THTSMDLED  [MX-1U-THTSMDLED]  56.62,66.15 180 top
X  KEYSWITCH-LED-MX-1U-LED  [MX-1U-LED]  66.15,28.05 180 top
X-1  KEYSWITCH-LED-MX-1U-LED  [MX-1U-LED]  70.91,28.05 180 top
Y  KEYSWITCH-THTSMDLED-MX-1U-THTSMDLED  [MX-1U-THTSMDLED]  132.82,66.15 180 top
Y1  8MHz  [CRYSTAL-3.2X2.5]  35.94,53.2 90 bottom
Z  KEYSWITCH-LED-MX-1U-LED  [MX-1U-LED]  47.1,28.05 180 top
Z-1  KEYSWITCH-LED-MX-1U-LED  [MX-1U-LED]  51.86,28.05 180 top
|  KEYSWITCH-THTSMDLED-MX-1U-THTSMDLED  [MX-1U-THTSMDLED]  270.94,66.15 180 top
~  KEYSWITCH-THTSMDLED-MX-1U-THTSMDLED  [MX-1U-THTSMDLED]  9,85.2 180 top

## Tracks (layer width: path | path; a pad name or v marks a point on that pad's centre or on a via)
ADCV  (via drill 0.35)
  Top 0.152: v22.25,43.08 27.98,43.08 28.84,43.93 v28.85,43.93 | v22.25,45.69 22.38,45.82 22.38,48.22 22.01,48.58 22.01,54.98 v22.17,55.14
  Bottom 0.152: R72.2 R75.1 30.14,45.22 v28.85,43.93 | v22.25,45.69 v22.25,43.08 | v22.17,55.14 v22.17,55.13 U3.55
AREF
  Bottom 0.152: C5.2 21.84,59.3
  Bottom 0.203: U3.62 23.17,58.63 22.88,58.92 22.23,58.92 21.84,59.3
BATT+  (via drill 0.3, 0.35)
  Top 0.152: v69.8,56.65 69.9,56.55 73.65,56.55 73.7,56.48
  Top 0.203: v80.44,57.17 80.44,57.15 79.77,56.48 73.7,56.48
  Top 0.254: v38.05,51.75 31.43,51.75 29.7,50.02 S2.P3 | v53.65,68.31 47.11,68.31 37.37,78.04 21.9,78.04 20.76,76.9 v20.76,76.87
  Bottom 0.152: 38.1,51.8 v38.05,51.75 | R72.1 29.76,47.3 S2.P3
  Bottom 0.203: R73.2 R82.2 R83.2 81.45,57.17 v80.44,57.17
  Bottom 0.254: 38.1,51.8 38.1,52.3 40.03,54.23 42.7,54.23 53.68,65.21 53.68,68.28 v53.65,68.31 | v69.8,56.65 69.8,59.95 61.28,68.47 53.81,68.47 v53.65,68.31 | v53.65,68.31 53.76,68.31 | v20.76,76.87 20.07,76.18 20.07,75.51
  Bottom 0.305: U6.14 U6.15 19.71,75.16 20.07,75.51 20.45,75.9 U6.16
BATT-  (via drill 0.35)
  Top 0.203: v72.25,53.86 74.42,56.03 87.55,56.03 v87.6,55.98
  Bottom 0.152: J1.1 69.08,53.86 v72.25,53.86 | U5.6 86.69,56.09
  Bottom 0.203: 86.69,56.09 86.69,57.27 | 86.69,57.27 C14.1 | U5.6 87.55,56.03 v87.6,55.98 | 86.69,57.27 88.56,57.27 89.07,56.75 89.07,56.11 Q2.6
  Bottom 0.254: Q2.7 Q2.6 89.02,56.1
BATTSWITCH  (via drill 0.35)
  Top 0.152: 40.7,50.52 v40.7,50.37 | S2.P2 26.4,44.9 26.45,44.9 26.55,44.87
  Top 0.203: J1.2 67.75,50.52 40.7,50.52 | v36.32,44.57 26.85,44.57 26.55,44.87
  Bottom 0.203: v40.7,50.37 39.45,49.13 39.45,47.33 36.69,44.57 v36.32,44.57
BL  (via drill 0.35)
  Top 0.152: v34.38,73 34.38,73.07 35.79,74.48 v36.98,74.48
  Bottom 0.152: U3.16 31.8,61.71 34.24,64.16 34.24,72.87 v34.38,73 | 75.32,74.48 R71.1 | v34.38,73
  Bottom 0.203: 75.32,74.48 v36.98,74.48
COL1  (via drill 0.3)
  Top 0.152: v21.34,50.27 21.34,48.93 17.81,45.4 17.81,44.23 15.65,42.07 13.72,42.07 CAPS-TRAD.MX2 13.57,42.07 8.85,42.07 CAPS-STEPPED.MX2 8.84,39.64 11.45,37.03 11.45,25.05 13.53,22.97 LSHIFT-1U.MX2 LSHIFT-TRAD.MX2
  Bottom 0.152: LSHIFT-TRAD.MX2 18.45,22.87 21.95,19.37 21.95,5.58 20.34,3.97 LCTRL1.MX2 LCTRL.MX2 | v21.34,50.27 21.34,51.46 23.01,53.12 23.6,53.12 U3.51 | CAPS-STEPPED.MX2 8.85,42.07 8.85,58.68 11.13,60.97 TAB.MX2 10.98,61.21 10.98,66.81 6.39,71.41 6.39,80.05 ~.MX2
COL2  (via drill 0.3)
  Top 0.152: v34.88,69.35 34.85,69.35 31.12,73.08 v31.12,76.09 | v22.87,42.31 23.09,42.31 23.17,42.23 24.65,42.23 26.46,40.43 38.21,40.43 A.MX2 | Z-1.MX2 49.23,23.02 44.66,23.02 Z.MX2 | v51.52,59.75 51.37,59.6 36.43,59.6 35.06,60.97 Q.MX2
  Bottom 0.152: v34.88,69.35 34.88,61.15 34.91,61.12 Q.MX2 | v22.87,42.31 22.87,52.34 23.19,52.66 23.58,52.66 U3.50 | Z.MX2 44.51,22.87 44.11,22.47 44.11,15 40.34,11.23 32.9,11.23 31.34,9.67 31.34,8.03 32.65,6.72 LOPT.MX2 LOPT1.MX2 | 51.82,35.06 50.93,35.95 42.4,35.95 40.55,37.8 40.55,41.31 39.94,41.92 A.MX2 | 51.82,35.06 51.82,31.25 49.39,28.81 49.39,23.02 Z-1.MX2 | v51.52,59.75 52.13,59.14 52.13,35.37 51.82,35.06 | 29.98,78.71 29.98,77.23 v31.12,76.09
  Bottom 0.203: 1.MX2 28.57,80.12 29.98,78.71
COL3  (via drill 0.3)
  Top 0.152: X-1.MX2 68.28,23.02 63.71,23.02 X.MX2 | v23.78,41.46 24.68,41.46 26.19,39.95 40.45,39.95 40.89,40.39 v42.68,40.39 | S.MX2 58.73,42.14 v45.77,42.14 | v37.29,62.57 38.73,61.12 53.96,61.12 W.MX2 | 2.MX2 44.37,79.93 v44.37,72.98
  Bottom 0.152: LCMD.MX2 56.55,3.97 58.74,3.97 61.27,6.5 61.27,7.96 65.2,11.88 65.2,21.38 X.MX2 58.99,27.59 58.99,41.92 S.MX2 58.84,42.07 54.72,46.19 54.72,60.36 54.11,60.97 W.MX2 | v23.78,41.46 23.78,52.05 23.71,52.12 U3.49 | v45.77,42.14 45.77,41.99 44.17,40.39 v42.68,40.39 | v44.37,72.98 44.37,72.68 40.87,69.18 36.29,69.18 35.21,68.1 35.21,64.64 v37.29,62.57
COL4  (via drill 0.3)
  Top 0.152: v24.4,38.41 24.55,38.41 24.78,38.18 26.78,36.17 26.78,34.69 31.9,29.57 44.97,29.57 46.03,30.64 74.99,30.64 C.MX2 82.76,23.02 87.33,23.02 C-1.MX2 | v67.64,60.05 72.09,60.05 73.01,60.97 E.MX2 | 3.MX2 63.1,79.61 v63.1,71.03
  Bottom 0.152: v24.4,38.41 24.4,42.52 24.09,42.83 24.09,50.94 24.3,51.16 U3.48 | v63.1,71.03 73.01,61.12 E.MX2 | C.MX2 78.41,27.22 78.41,38.86 75.25,42.02 | 75.25,42.02 67.27,50 67.27,59.68 v67.64,60.05 | D.MX2 75.25,42.02
COL5  (via drill 0.3)
  Top 0.152: V.MX2 101.81,23.02 106.38,23.02 V-1.MX2 | v33.54,54.26 33.46,54.19 25.75,54.19 24.7,53.13 v24.7,50.45 | v33.54,55.48 33.91,55.48 37.57,59.14 90.23,59.14 92.06,60.97 R.MX2
  Bottom 0.152: V.MX2 101.66,23.02 101.66,29.43 97.7,33.39 97.7,41.31 97.09,41.92 F.MX2 96.94,42.07 96.16,42.84 96.16,54.85 92.21,58.8 92.21,60.97 R.MX2 92.19,68.65 82.66,78.17 4.MX2 | v24.7,50.45 24.7,51.37 U3.47 | v33.54,55.48 v33.54,54.26
COL6  (via drill 0.3, 0.35)
  Top 0.152: B.MX2 120.86,23.02 125.43,23.02 B-1.MX2 | v50.91,60.36 51.84,60.36 52.76,59.44 88.4,59.44 91.6,62.65 97.24,62.65 98.76,61.12 111.11,61.12 | 111.11,61.12 111.38,61.12 103.6,68.9 103.6,71.37 v101.2,73.77 | 111.11,61.12 T.MX2 | v37.98,44.65 37.46,45.17 28.05,45.17 28.04,45.17 25.32,47.89 v25.29,47.89 | 5.MX2 101.15,79.56 v101.15,75.8
  Bottom 0.152: SPACE.MX2 127.87,3.97 127.42,4.42 127.42,21.04 125.59,22.87 B-1.MX2 | v37.98,44.65 39.04,43.6 42.36,43.6 44.86,46.1 44.86,47.16 50.91,53.2 v50.91,60.36 | T.MX2 111.26,60.97 111.26,47.32 115.81,42.77 G.MX2 116.88,41.38 116.88,27.3 120.76,23.42 B.MX2 | v25.29,47.89 25.3,47.9 U3.46 | v101.2,73.77 101.2,75.75 v101.15,75.8
COL7  (via drill 0.3)
  Top 0.152: N.MX2 139.91,23.02 144.48,23.02 N-1.MX2 | v39.17,46.12 38.85,45.8 28.51,45.8 26.59,47.72 v26.59,49.3 | v46.99,57.37 48.45,58.84 128.02,58.84 130.16,60.97 Y.MX2 | v46.99,57.37 | 6.MX2 120.76,79.97 v129.56,71.17
  Bottom 0.152: N.MX2 135.8,26.98 135.8,41.31 135.19,41.92 H.MX2 134.79,42.02 133.9,42.91 133.9,52.99 130.28,56.61 Y.MX2 130.16,61.12 130.16,63.73 129.56,64.33 v129.56,71.17 | v39.17,46.12 39.79,46.74 39.79,48.03 42.38,50.62 42.38,52.74 46.99,57.35 v46.99,57.37 | U3.44 26.3,49.59 v26.59,49.3
COL8  (via drill 0.3)
  Top 0.152: M.MX2 158.96,23.02 163.53,23.02 M-1.MX2 | v41.93,44.2 42.57,44.2 46.9,39.87 151.95,39.87 J.MX2 | v25.92,48.56 25.92,47.82 28.25,45.49 38.65,45.49 v39.03,45.12 | 7.MX2 v148.76,71.17
  Bottom 0.152: v41.93,44.2 39.99,44.2 39.07,45.12 v39.03,45.12 | v148.76,71.17 148.76,70.87 | 148.76,70.87 | 148.76,70.87 148.76,64.33 149.21,63.88 149.21,61.12 U.MX2 149.23,60.96 149.23,52.59 153.5,48.31 153.5,42.62 J.MX2 154.83,41.49 154.83,27 M.MX2 | v25.92,48.56 26,48.56 25.8,48.76 U3.45
COL9  (via drill 0.3, 0.35)
  Top 0.152: ,.MX2 178.01,23.02 182.58,23.02 ,-1.MX2 | v41.16,39.79 40.86,39.49 25.31,39.49 v25.01,39.79 | K.MX2 173.13,42.07 165.22,49.98 132.03,49.98 131.41,50.6 124.71,50.6 124.19,50.08 48.86,50.08 v48.17,49.39 | 8.MX2 v167.81,71.17 | v167.81,71.17
  Bottom 0.152: U3.38 29.27,51.37 29.35,51.29 29.35,50.03 25.01,45.7 v25.01,39.79 | v167.81,71.17 167.81,63.58 168.26,63.13 168.26,61.12 I.MX2 168.28,60.96 168.28,52.14 172.73,47.69 172.73,42.44 K.MX2 174.03,41.38 174.03,26.85 ,.MX2 | v41.16,39.79 43.53,42.16 43.53,44.27 45.17,45.9 45.17,46.81 47.75,49.39 v48.17,49.39
COL10  (via drill 0.3)
  Top 0.152: RCMD-1U.MX2 197.06,3.97 199.19,3.97 RCMD-TRAD.MX2 | v26.07,35.98 26.07,34.78 31.58,29.27 45.12,29.27 46.19,30.34 72.09,30.34 81.09,21.34 v99.19,21.34 | v103.1,21.38 103.1,21.34 195.38,21.34 196.91,22.87 ..MX2 197.06,23.02 201.63,23.02 .-1.MX2 | 9.MX2 186.56,71.47 v186.56,71.17
  Bottom 0.152: v186.56,71.17 186.56,68.49 187.31,67.75 187.31,61.12 O.MX2 187.33,60.96 187.33,47.38 192.04,42.67 L.MX2 192.34,41.92 192.95,41.31 192.95,26.98 ..MX2 196.91,22.87 195.69,21.65 195.69,5.19 RCMD-1U.MX2 | v26.07,35.98 26.07,40.14 25.32,40.89 25.32,45.52 29.8,50 U3.37 | v99.19,21.34 99.19,21.38 v103.1,21.38
COL11  (via drill 0.3)
  Top 0.152: /.MX2 216.11,23.02 220.68,23.02 /-1.MX2 | v179.07,5.18 179.51,5.18 179.67,5.02 190.45,5.02 193.18,2.29 214.44,2.29 215.96,3.82 ROPT-1U.MX2 216.11,3.97 223.12,3.97 ROPT-TRAD.MX2 | 0.MX2 205.46,71.62 v205.46,71.17
  Bottom 0.152: v205.46,71.17 205.46,68.49 206.36,67.6 206.36,61.12 P.MX2 206.38,60.96 206.38,46.93 211.23,42.07 SEMICOL.MX2 211.39,41.92 212,41.31 212,27.36 216.01,23.34 /.MX2 215.96,22.87 215.96,3.97 ROPT-1U.MX2 | v179.07,5.18 175.36,1.48 122.04,1.48 117.19,6.32 104.86,6.32 104.41,6.77 93.39,6.77 91.48,4.86 80.16,4.86 77.29,1.99 31.88,1.99 28.6,5.27 28.6,17.76 27.46,18.91 27.46,47.18 30.18,49.91 30.18,51.37 U3.36
COL12  (via drill 0.3)
  Top 0.152: LEFT.MX2 235.16,3.97 246.9,3.97 RMOD1-TRAD.MX2 | v34.15,46.55 30.8,49.9 30.79,49.9 v30.79,49.83 | v42.98,36.58 42.34,36.58 40.7,38.22 v34.9,38.22 | v44.97,36.58 44.97,37.97 46.47,39.48 82.13,39.48 82.15,39.5 227.87,39.5 230.28,41.92 '.MX2 | -.MX2 224.24,71.89 v224.24,70.77 | TS_SH.MX2 246.97,21.78 246.37,21.18 235.8,21.18 235.06,21.93 RSHIFT-1U.MX2 ASHIFT.MX2
  Bottom 0.152: LEFT.MX2 235.01,3.97 235.01,22.87 RSHIFT-1U.MX2 236.01,23.92 236.01,25.92 233.67,28.26 233.67,33.2 230.3,36.57 '.MX2 | v30.79,49.83 30.79,51.37 U3.35 | v34.9,38.22 34.15,38.97 v34.15,46.55 | v44.97,36.58 v42.98,36.58 | 230.44,41.92 '.MX2 | v224.24,70.77 224.24,68.54 225.41,67.38 225.41,61.12 [.MX2 225.43,60.96 225.43,52.29 229.58,48.13 229.58,42.74 '.MX2
COL13  (via drill 0.3)
  Top 0.152: RSHIFT-TRAD.MX2 256.34,23.02 254.21,23.02 UP.MX2 | v32.59,38.54 32.88,38.83 40.62,38.83 42.25,37.19 v43.59,37.19 | v51.52,56.85 53.2,58.53 242.02,58.53 244.46,60.97 ].MX2
  Bottom 0.152: v51.52,56.85 51.52,37.83 50.89,37.19 v43.59,37.19 | 244.62,61.12 244.61,61.12 ].MX2 | 244.62,61.12 244.62,58.04 260.64,42.02 ENTER-2U.MX2 259.56,42.02 252.87,35.33 252.87,27.48 251.52,26.13 251.52,24.44 253.47,22.49 | U3.34 31.29,51.44 31.29,51.1 32.93,49.47 32.93,38.88 v32.59,38.54 | 244.62,61.12 245.4,61.12 252.03,67.75 252.03,73.35 251.31,74.06 241.12,74.06 =.MX2 | DOWN.MX2 254.11,5.13 254.81,5.84 254.81,7.25 253.51,8.55 253.51,9.45 254,9.94 254,21.96 253.47,22.49 | UP.MX2 253.63,22.49 253.47,22.49
COL14  (via drill 0.3)
  Top 0.152: v48.46,11.24 48.48,11.27 49.87,9.87 52.63,7.12 56.34,7.12 58.72,4.73 125.91,4.73 126.67,5.5 132.31,5.5 134.44,3.36 178.04,3.36 178.79,4.12 190.21,4.12 192.65,1.69 268.54,1.69 270.67,3.82 RMOD2-TRAD.MX2 270.82,3.97 273.11,3.97 RIGHT.MX2 | |.MX2 268.54,60.97 268.54,57.16 272.77,52.93 272.77,38.04 274.64,36.24 277.93,36.24 278.74,35.43 278.74,27.27 274.44,22.97 ESC.MX2 | v33.4,26.79 33.41,23.55 37.18,19.78 44.81,19.78 v45.11,19.48 | BS.MX2 266.81,80.12 267.7,79.23 272.27,79.23 BS-R.MX2
  Bottom 0.152: ESC.MX2 273.11,22.87 269.45,19.21 269.45,5.19 270.67,3.97 RMOD2-TRAD.MX2 | v33.4,26.79 33.41,32.8 34.78,34.18 34.78,35.94 33.23,37.49 33.23,49.77 31.8,51.2 U3.33 | |.MX2 267.95,61.52 267.95,67 266.49,68.46 266.49,77.48 263.86,80.12 BS.MX2 1U-BS.MX2 | v48.46,11.24 48.46,11.29 45.11,14.65 v45.11,19.48
CS_3.3V  (via drill 0.35)
  Top 0.203: v99.19,12.87 v96.06,12.87
  Bottom 0.152: D130.A 93.29,8.7 93.29,8.55 92.25,7.51 R3.1
  Bottom 0.203: BLE.7 96.04,12.85 v96.06,12.87 | D130.A 93.47,8.67 97.3,8.67 99.19,10.56 v99.19,12.87
CS_5V  (via drill 0.3)
  Top 0.152: v91.85,12.51 91.81,12.54 80.81,12.54 72.93,20.42 v62.65,20.42 | v31.92,63.22 37.7,63.22 39.4,61.51 51.91,61.51 v52.43,62.04
  Bottom 0.152: v62.65,20.42 58.07,25 58.07,39.65 52.43,45.29 v52.43,62.04 | U3.14 30.79,60.36 30.79,61.54 30.95,61.69 30.95,62.4 31.77,63.22 v31.92,63.22 | v31.92,63.22
  Bottom 0.203: v91.85,12.51 91.85,9.31 D130.C
GND  (via drill 0.3, 0.35)
  Bottom 0.152: 26.68,59.14 23.63,59.14 U3.63 23.14,59.13 22.19,60.07 20.71,60.07 19.95,59.3 C5.1 | 26.68,59.14 26.68,60.21 U3.6 | U3.53 23.63,54.11 28.05,54.11 U3.65 28.05,57.16 | 28.05,57.16 32.32,57.16 U3.22 32.6,57.13 32.62,57.16 | 26.68,59.14 28.05,57.77 28.05,57.16 | v27.55,49.14 v27.55,49.15 28.25,49.85 R4.1 | v90.56,14.51 89.81,13.76 U1.2 | 21.93,73.35 22.59,72.68 22.91,72.68 23.38,72.21 23.38,71.75 v23.36,71.73 23.36,71.34 R87.1 | 21.93,73.35 21.65,73.62 | U6.3 U6.21 | R90.1 18.58,71.45 v19.27,70.76 | U6.11 20.91,72.96 | 20.91,72.96 21.54,72.96 21.93,73.35 | U6.10 20.64,72.43 20.91,72.69 20.91,72.96 | C43.1 26.73,75.53 C45.1 | C45.1 | C45.1 C44.1 28.07,73.43 27.51,72.87 27.51,72.29 U7.1 27.52,71.96 27.81,71.67 27.89,71.67 U7.9 28.66,70.9 28.74,70.9 28.89,70.74 28.89,70.43 U7.5
  Bottom 0.203: C11.1 83.12,15.12 83.12,18.25 79.57,21.79 v78.97,21.79 | C9.2 35.01,55.68 Y1.2 | C5.1 19.51,59.38 | BLE.2 BLE.1 | v102.46,5.58 103.36,5.58 BLE.42 | C10.1 91.28,14.51 v90.56,14.51 | Q2.3 Q2.2
  Bottom 0.254: R86.1 v30.88,68.83 | v30.88,68.83 | C12.1 88.23,10.62 v88.2,10.65 | C15.1 18.91,56.55 | C13.1 19.49,62.26 v19.49,62.65 | C5.1 19.43,59.46 18.11,59.46 17.81,59.16 17.81,58.42 18.77,57.46 v18.82,57.52 C15.1 | v22.62,54.32 22.62,54.26 22.73,54.15 23.59,54.15 23.63,54.11 | U4.2 18.12,83.44 18.12,83.88 18.33,84.08 v19.27,84.08 | C15.1
  Bottom 0.305: USB-C.SHIELD@2 21.48,87.7 USB-C.B1 | C2.1 C3.1 C4.1 | C4.1 | 21.53,73.96 U6.21 21.65,73.62 | C1.1 22.79,82.97 | R88.1 v18.38,77.83
  other vias: 37.81,50.66 99.5,8.24 43.97,26.49 35.49,31.77 37.72,26.93 246.68,20.31 23.59,14.43 244.22,80.29 259.78,60.49 193.84,17.48 190.87,30.58 190.87,36.38 117.5,3.27 279.72,57.07 228.67,36.09 26.41,10.19 43.16,15.18 51.27,12.57 4.39,76.27 13.91,62.43 104.7,61.98 212.75,17.33 244.45,46.8 21.65,38.17 56.18,35.19 71.81,48.07 53.35,52.46 56.62,52.46 50.82,52.16 52.31,72.48 232.54,14.06 232.69,19.42 231.8,6.32 261.26,22.25 281.65,32.37 280.91,22.54 281.36,16.74 272.13,57.67 271.83,87.88 247.27,90.93 235.59,75.3 91.53,45.46 87.73,43.38 93.68,23.29 103.65,19.86 109.16,14.21 133.72,24.48 72.4,37.65 60.49,44.27 56.48,61.24 35.71,24.4 26.56,26.41 28.65,30.28 20.76,41.3 18.97,49.63 134.76,4.09 174.2,16 183.43,17.33 201.43,3.94 219.59,3.05 219.59,4.98 120.17,41.74 139.08,41.74 109.76,41.74 80.44,23.44 85.2,18.53 74.48,5.58 61.24,19.42 66.15,16.59 15.03,75.45 12.35,87.13 12.27,90.86 24.92,90.71 268.26,30.88 50.3,13.61 41.52,10.49 54.39,23.88 47.4,22.25 44.57,30.28 31.18,48.22 24.92,46.95 15.7,31.18 17.19,20.31 19.27,17.41 66,3.49 79.84,31.92 59.16,65.18 78.65,61.54 274.36,70.02 270.19,77.76 44.72,66 49.48,47.1 61.09,76.57 49.26,67.12 66.15,13.47 22.39,41.3 5.87,48.89 18.75,38.32 46.8,60.35 71.28,61.46 53.35,41 64.81,49.18 118.24,36.38 50.67,40.85 44.5,58.41 67.04,61.46 54.99,28.2 207.61,79.32 94.8,91 41,78.06 91.82,80.21 269.9,42.04 61.69,61.39 74.48,31.92 62.58,56.33 25.82,83.12 147.93,79.99 153.96,87.21 38.77,54.47 18.08,42.56 241.4,2.97 121.81,5.58 91.53,57.67 36.61,41.74 53.57,56.92 41,56.03 96.59,37.13 32.59,60.42 48.74,53.57 44.64,43.38 29.02,38.1 11.08,38.99 28.57,22.32 269,89.37 262.6,89.52 260.67,91.15 267.37,35.79 200.1,71.95 216.91,71.81 224.8,23.88 212.89,32.96 93.39,52.46 64.51,60.49 21.95,20.46 136.69,15.4 250.85,23.73 43.97,13.17 42.49,21.95 85.2,7.07 95.92,5.58 116.16,7.81 85.8,24.92 76.42,2.97 90.93,10.41 37.58,91 75.82,91 113.63,91 132.82,91 151.88,91 170.92,91 189.97,91 209.02,91 263.79,37.58 267.37,55.29 250.55,20.01 156.94,18.67 162.14,72.1 143.09,72.1 124.04,72.1 119.13,18.82 14.51,39.06 97.11,16.29 99.93,19.57 266.32,23.44 109.16,10.64 69.42,15.4 113.33,20.46 176.13,18.67 170.63,20.46 151.43,20.46 208.58,20.46 36.24,19.42 29.91,14.73 44.12,3.34 107.08,17.48 130.22,17.56 11.08,43.08 43.9,57.22 24.63,77.09 31.47,64.74 74.78,20.39 73.96,15.4 273.17,30.36 40.4,67.34 29.61,71.28 29.98,68.83 31.77,68.83 30.88,67.79 29.98,67.79 29.09,67.79 31.77,69.8 31.77,70.76 32.74,70.24 32.74,69.28 28.2,68.31 26.41,68.31 25.07,68.31 23.66,68.31 25.15,64.66 26.49,64.66 23.73,64.66 0.81,39.58 1.86,39.58 2.9,39.58 3.94,39.58 4.98,39.58 6.1,38.91 6.4,37.95 6.1,37.05 4.98,36.31 4.01,36.31 2.97,36.31 1.93,36.31 0.89,36.31 126.5,48.81 127.99,48.81 129.55,48.81 126.5,45.39 128.06,45.39 129.63,45.39 188.71,10.86 190.42,10.86 192.13,10.86 192.21,7.51 190.5,7.44 188.71,7.44 189.53,11.38 191.24,11.38 191.39,6.92 189.6,6.92 128.81,44.87 127.24,44.87 127.24,49.41 128.81,49.41 24.4,64.14 25.82,64.14 25.74,68.9 24.4,68.9 284.56,39.66 283.59,39.66 282.62,39.66 281.65,39.66 280.69,39.66 279.72,39.66 278.68,39.21 278.3,38.02 278.6,36.76 279.72,36.31 280.69,36.31 281.65,36.31 282.62,36.31 283.59,36.31 284.56,36.31 261.64,68.16 260,68.16 258.21,68.16 258.14,64.81 259.85,64.81 261.56,64.81 258.96,64.22 260.67,64.22 259.11,68.75 260.82,68.75 17.93,68.01 16.52,61.61 35.86,84.46 39.06,63.77 210.14,8.93 193.84,3.87 222.12,10.41 268.18,2.82 252.71,10.64 40.7,21.65 94.96,9.28 95.93,9.28 96.82,9.5 97.57,10.17 92.73,9.5 101.51,17.39 98.69,17.39 96.3,14.41 100.17,16.13 101.81,14.49 100.99,12.93 103.08,12.85 93.25,13.74 86.78,13.74 104.79,15.08 104.79,17.61 104.79,16.35 37.35,57.44 30.06,6.1 13.39,26.34
  pour Top (isolate 0.305, hatched): -1.12,-0.67 286.27,-0.67 286.27,95.32 -1.12,95.32
  pour Bottom (isolate 0.305): -1.12,-0.67 286.27,-0.67 286.27,95.32 -1.12,95.32
IRQ  (via drill 0.3)
  Top 0.152: 91.22,24.06 91.22,25.55 93.16,27.48 v93.16,38.86 | v91.22,23.76 91.22,24.06 | 91.22,24.06 | v93.16,38.86
  Bottom 0.152: U3.18 32.52,59.17 35.67,59.17 39.78,63.27 39.78,65.02 43.73,68.97 62.74,68.97 72.59,59.13 73.76,59.13 74.93,57.95 74.93,56.96 76.37,55.51 80.51,55.51 83.12,52.9 83.12,51.18 93.16,41.09 v93.16,38.86
  Bottom 0.203: v91.22,23.76 91.22,20.19 93.45,17.96 93.45,14.68 BLE.8
LED_OUT  (via drill 0.3, 0.35)
  Top 0.152: 1.SMDLED- 26.78,91.96 1.LED- | 3.SMDLED- 64.88,91.96 3.LED- 63.26,88.66 | 4.SMDLED- 83.93,91.96 4.LED- 82.31,88.66 | 5.SMDLED- 102.95,90.41 | 102.95,90.41 102.95,90.31 5.LED- | 6.SMDLED- 122,90.31 122.01,90.31 | 122.01,90.31 6.LED- | 7.SMDLED- 141.05,90.31 7.LED- 139.46,88.66 | 8.SMDLED- 160.1,90.31 8.LED- 158.51,88.66 | 9.SMDLED- 179.15,90.31 9.LED- 177.56,88.66 | 0.SMDLED- 198.2,90.31 0.LED- 196.61,88.66 | -.SMDLED- 217.25,90.31 -.LED- 215.66,88.66 | =.SMDLED- 236.3,90.31 | 236.3,90.31 =.LED- | BS.SMDLED- 264.88,90.31 | 264.88,90.31 BS.LED- 264.96,90.28 266.6,88.64 272.79,88.64 BS-R.LED- 274.4,90.31 BS-R.SMDLED- | TAB.LED- 12.46,71.26 TAB.SMDLED- 12.35,73.01 12.35,77.95 6.62,83.68 6.62,89.17 ~.LED- 7.7,90.31 ~.SMDLED- 7.78,92.06 8.59,92.86 11.39,92.86 12.94,91.31 26.08,91.31 1.SMDLED- | Q.SMDLED- 36.28,71.26 Q.LED- 36.43,71.18 37.96,69.65 v43.3,69.65 | W.SMDLED- 55.33,71.26 W.LED- | R.SMDLED- 93.42,71.26 R.LED- | Y.SMDLED- 131.52,71.26 Y.LED- 131.53,71.18 129.86,69.51 | U.SMDLED- 150.57,71.26 U.LED- 150.58,71.18 148.91,69.51 | I.SMDLED- 169.62,71.26 I.LED- 169.63,71.18 167.96,69.51 | O.SMDLED- 188.67,71.26 O.LED- 188.68,71.18 187.01,69.51 | P.SMDLED- 207.72,71.26 P.LED- 207.58,70.88 206.21,69.51 | [.SMDLED- 226.77,71.26 [.LED- 226.78,71.18 225.11,69.51 | ].SMDLED- 245.82,71.26 ].LED- 245.83,71.18 244.16,69.51 | |.SMDLED- 269.64,71.26 |.LED- 269.6,71.18 269.34,70.91 255.61,70.91 254.21,69.51 244.16,69.51 | 1.SMDLED- 27.79,93.03 31.66,93.03 36.03,88.66 44.26,88.66 | W.LED- 55.33,71.18 53.81,69.66 53.14,69.66 v53.13,69.65 | R.SMDLED- 93.28,73.01 92.36,73.92 75.29,73.92 74.38,73.01 E.SMDLED- 74.38,71.26 E.LED- 74.38,71.18 72.86,69.66 64.14,69.66
  Top 0.152: 64.14,69.66 57,69.66 55.48,71.18 W.LED- | 129.86,69.51 114.3,69.51 112.63,71.18 T.LED- 112.48,71.26 T.SMDLED- 112.33,73.01 110.96,74.38 105.66,74.38 | 129.86,69.51 148.91,69.51 | 148.91,69.51 167.96,69.51 | 167.96,69.51 187.01,69.51 | 187.01,69.51 206.21,69.51 | 206.21,69.51 225.11,69.51 | 225.11,69.51 244.16,69.51 | 105.66,74.38 94.8,74.38 93.43,73.01 R.SMDLED- | 44.26,88.66 63.26,88.66 | 63.26,88.66 82.31,88.66 | 82.31,88.66 101.2,88.66 | 102.95,90.41 101.2,88.66 | 101.2,88.66 106.92,88.66 | 122.01,90.31 120.36,88.66 | 106.92,88.66 106.98,88.6 106.98,84.21 105.74,82.97 105.74,74.45 105.66,74.38 | 106.92,88.66 120.36,88.66 | 120.36,88.66 139.46,88.66 | 139.46,88.66 158.51,88.66 | 158.51,88.66 177.56,88.66 | 177.56,88.66 196.61,88.66 | 196.61,88.66 215.66,88.66 | 215.66,88.66 234.66,88.66 | 236.3,90.31 234.66,88.66 | 234.66,88.66 253.76,88.66 | 253.76,88.66 263.22,88.66 264.88,90.31 | 2.SMDLED- 45.83,91.96 2.LED- 45.83,90.23 44.26,88.66 | CAPS-STEPPED.LED- 10.08,52.21 CAPS-STEPPED.SMDLED- 10.71,53.89 11.59,54.76 13.88,54.76 14.84,53.8 | CAPS-TRAD.SMDLED- 14.84,53.8 | 14.84,53.8 14.84,52.21 CAPS-TRAD.LED- | A.LED- 41.04,52.21 A.SMDLED- 41.16,53.96 42.07,54.87 59.14,54.87 | S.LED- 60.09,52.21 S.SMDLED- 60.05,53.96 59.14,54.87 | D.LED- 79.14,52.21 D.SMDLED- 79.1,53.96 78.19,54.87 | F.LED- 98.19,52.21 F.SMDLED- 98.15,53.96 97.24,54.87 | G.LED- 117.24,52.21 G.SMDLED- 117.2,53.96 116.29,54.87 | H.LED- 136.29,52.21 H.SMDLED- 136.25,53.96 135.34,54.87 | J.LED- 155.34,52.21 J.SMDLED- 155.3,53.96 154.39,54.87 | K.LED- 174.39,52.21 K.SMDLED- 174.35,53.96 173.44,54.87 | L.LED- 193.44,52.21 L.SMDLED- 193.4,53.96 192.49,54.87